# EAGLE design garage door opener v1.3 2015 07 16 (EAGLE 7.5.0)
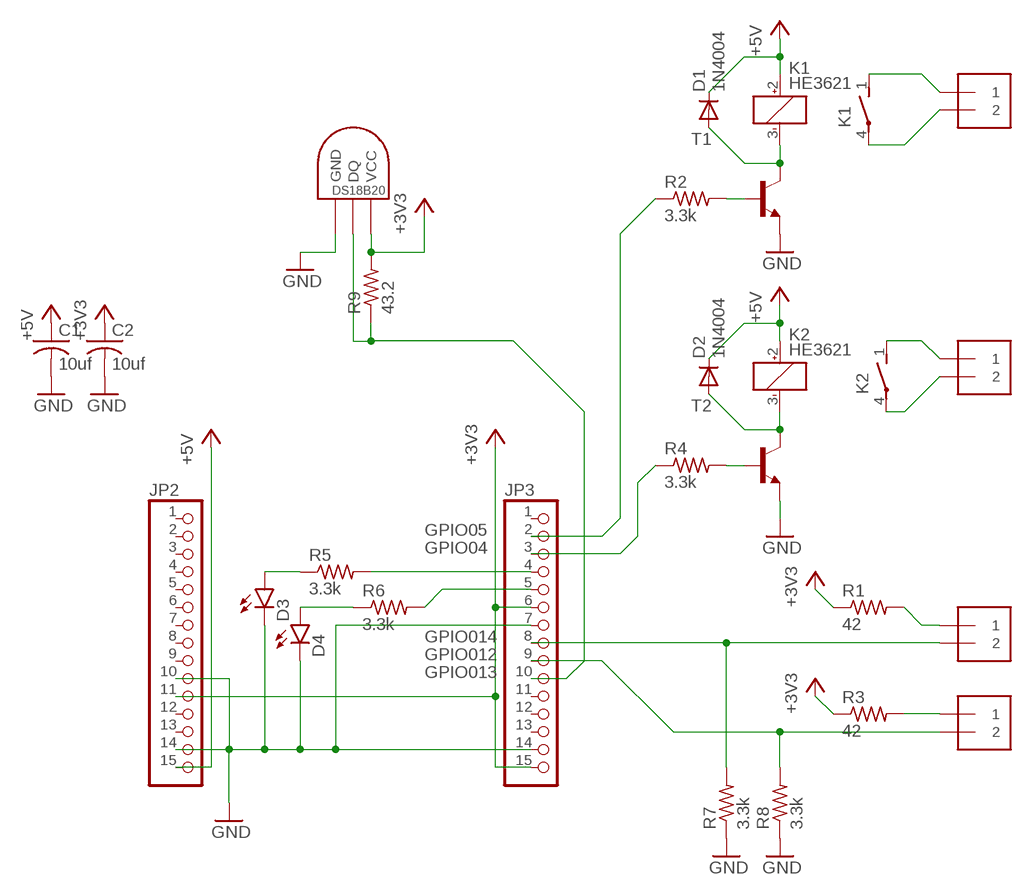
[diagram p0: schematic, sheet 1]

## Parts
C1  10uf  C-USC0603  [C0603]
C2  10uf  C-USC0603  [C0603]
D1  1N4004  DIODE-DO214BA  [DO214BA]
D2  1N4004  DIODE-DO214BA  [DO214BA]
D3  LED0603  [LED-0603]
D4  LED0603  [LED-0603]
DS18B20  DS18B20TO92  DS1820TO92  [DS1820]
JP2  PINHD-1X15  [1X15]
JP3  PINHD-1X15  [1X15]
K1  HE3621  [HE3621]
K2  HE3621  [HE3621]
OPEN1  1X2-3.5MM  [1X2-3.5MM]
OPEN2  1X2-3.5MM  [1X2-3.5MM]
R1  42  R-US_R0603  [R0603]
R2  3.3k  R-US_R0603  [R0603]
R3  42  R-US_R0603  [R0603]
R4  3.3k  R-US_R0603  [R0603]
R5  3.3k  R-US_R0603  [R0603]
R6  3.3k  R-US_R0603  [R0603]
R7  3.3k  R-US_R0603  [R0603]
R8  3.3k  R-US_R0603  [R0603]
R9  43.2  R-US_R0603  [R0603]
SENS1  1X2-3.5MM  [1X2-3.5MM]
SENS2  1X2-3.5MM  [1X2-3.5MM]
T1  MMBT3904LT1-NPN-SOT23-BEC  [SOT23-BEC]
T2  MMBT3904LT1-NPN-SOT23-BEC  [SOT23-BEC]

## Nets
+3V3: C2.1 DS18B20.VDD(VCC) JP2.11 JP3.6 JP3.15 R1.1 R3.1 R9.2
+5V: C1.1 D1.C D2.C JP2.15 K1.2(1:+) K2.2(1:+)
GND: C1.2 C2.2 D3.C D4.C DS18B20.GND JP2.10 JP2.14 JP3.7 JP3.14 R7.1 R8.1 T1.E T2.E
N$10: K1.1(2:S) OPEN1.1
N$11: K1.4(2:P) OPEN1.2
N$14: JP3.8 R7.2 SENS1.2
N$15: R1.2 SENS1.1
N$16: D1.A K1.3(1:-) T1.C
N$17: JP3.2 R2.1
N$18: R2.2 T1.B
N$19: JP3.4 R5.2
N$20: JP3.5 R6.2
N$21: R3.2 SENS2.1
N$22: JP3.9 R8.2 SENS2.2
N$23: K2.1(2:S) OPEN2.1
N$24: K2.4(2:P) OPEN2.2
N$25: D2.A K2.3(1:-) T2.C
N$26: JP3.3 R4.1
N$27: R4.2 T2.B
N$28: D4.A R6.1
N$29: D3.A R5.1
N$30: DS18B20.DQ JP3.10 R9.1
Unconnected: JP2.1 JP2.2 JP2.3 JP2.4 JP2.5 JP2.6 JP2.7 JP2.8 JP2.9 JP2.12 JP2.13 JP3.1 JP3.11 JP3.12 JP3.13

## Notes on the sheet
- GPIO05
- GPIO04
- GPIO014
- GPIO012
- GPIO013

## Library data of the parts
C1 C2 = resistor:C-US: CAPACITOR, American symbol
D1 D2 = diode:DIODE-: DIODE
D3 D4 = SparkFun-LED:LED: LEDs Standard schematic elements and footprints for 5mm, 3mm, 1206, and 0603 sized LEDs. 5mm - Spark Fun Electronics SKU : COM-00529 (and others)
DS18B20 = Ava:DS1820: DS18B20 Programmable Resolution 1-Wire Digital Thermometer Description The DS18B20 digital thermometer provides 9-bit to 12-bit Celsius temperature measurements and has an alarm function with nonvolatile user-programmable upper and lower trigger points. The DS18B20 communicates over a 1-Wire® bus that by definition requires only one data line (and ground) for communication with a central microprocessor. It has an operating temperature range of -55°C to +125°C and is accurate to ±0.5°C over the range of -10°C to +85°C. In addition, the DS18B20 can derive power directly from the data line ("parasite power"), eliminating the need for an external power supply. Each DS18B20 has a unique 64-bit serial code, which allows multiple DS18B20s to function on the same 1-Wire bus. Thus, it is simple to use one microprocessor to control many DS18B20s distributed over a large area. Applications that can benefit from this feature include HVAC environmental controls, temperature monitoring systems inside buildings, equipment, or machinery, and process monitoring and control systems.
JP2 JP3 = pinhead:PINHD-1X15: PIN HEADER
K1 K2 = relay:HE3621: RELAY reed, 1 x norm. open, grid 5.08 mm, Hamlin; MF: HAMLIN; MPN: HE3621A0510; OC_FARNELL: 9561943; OC_NEWARK: 50F7993
OPEN1 OPEN2 SENS1 SENS2 = adafruit:1X2: 3.5mm Terminal block http://www.ladyada.net/library/pcb/eaglelibrary.html; MPN: OSTTE020161
R1-R9 = resistor:R-US_: RESISTOR, American symbol
T1 T2 = transistor-neu-to92:*-NPN-: NPN Transistror; MPN: MMBT2222A

## Net classes
0 default: width 0.406 mm

## Board
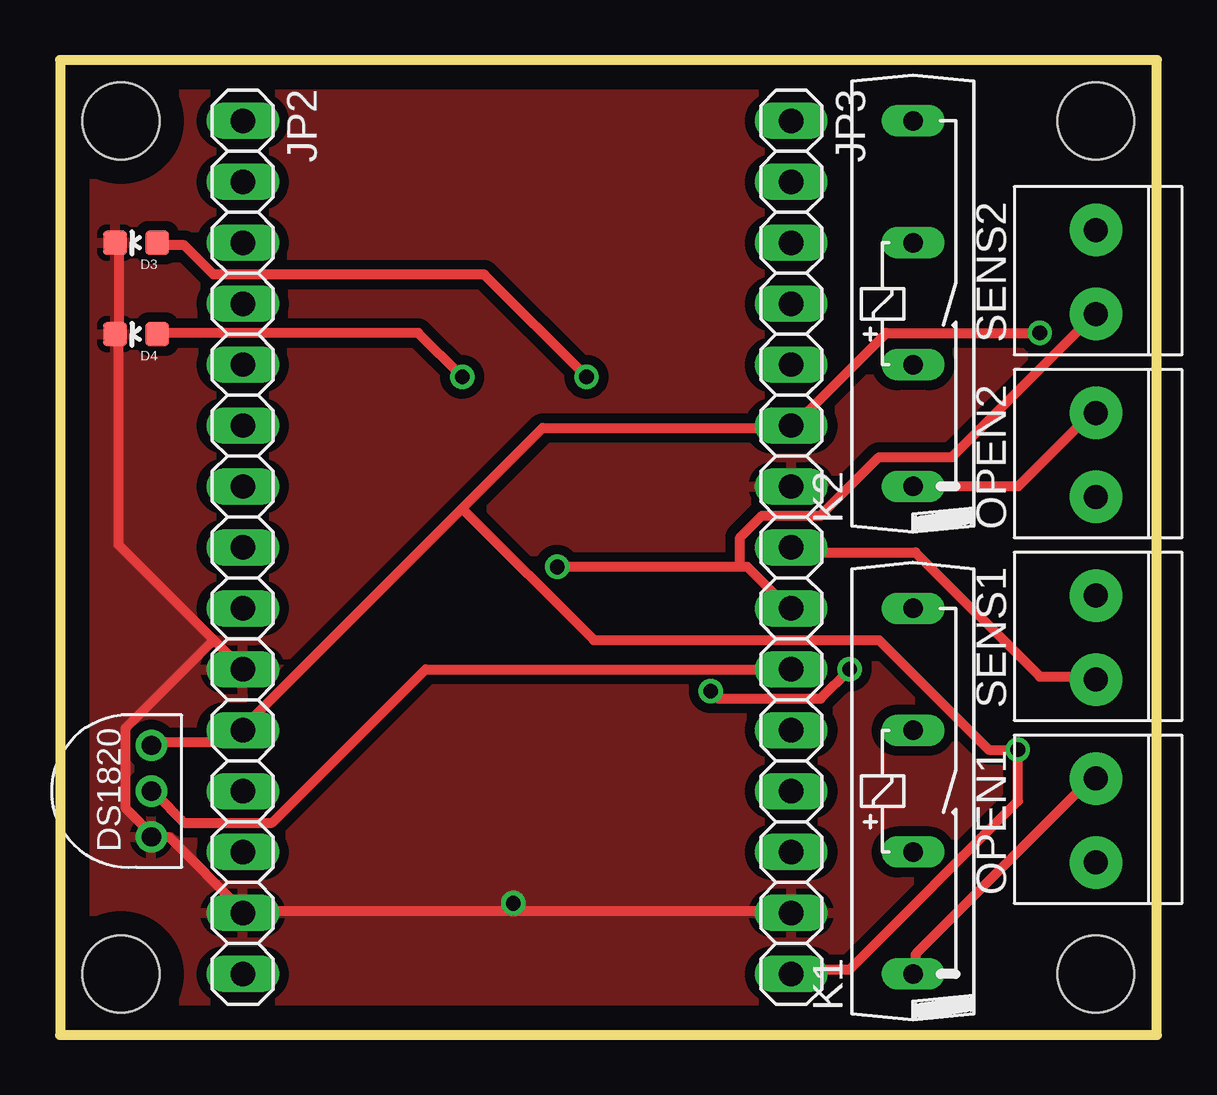
[diagram p1: board, top side]
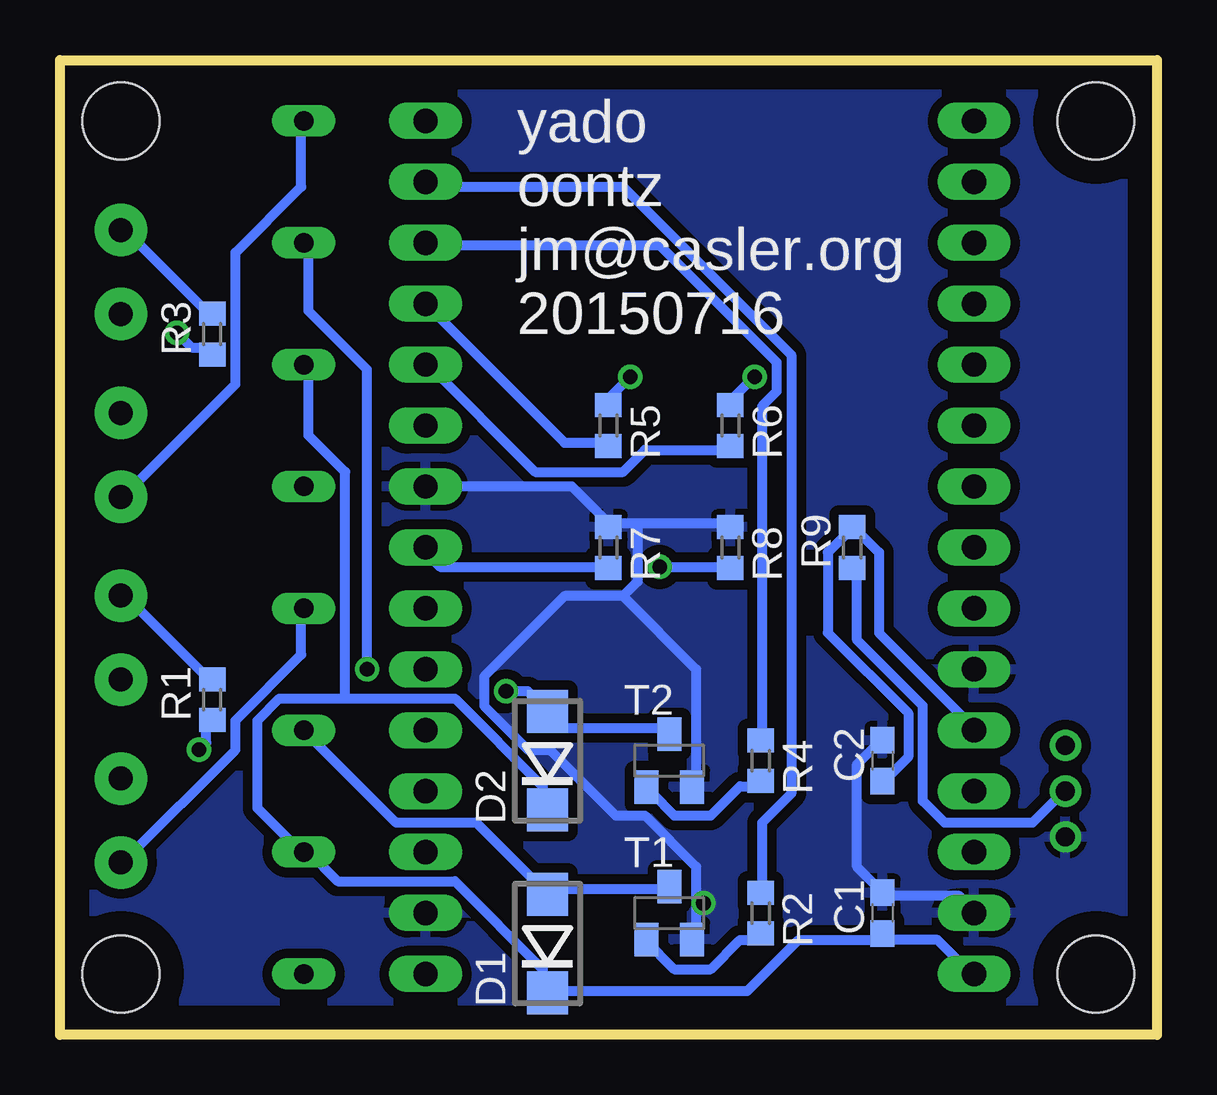
[diagram p2: board, bottom side, seen from below]

Size 45.72 x 40.64 mm. Coordinates in mm from the lower left corner, seen from the top.
Outline: 0,0 45.72,0 45.72,40.64 0,40.64 0,0
Copper layers (1*16): Top 0.035mm / dielectric 1.5mm / Bottom 0.035mm
Design rules "default *": minimum track width 10mil, minimum drill 24mil, track to track 8mil, track to pad 8mil, pad to pad 8mil, via to via 8mil, smd to smd 8mil, copper to edge 40mil, drill to drill 8mil, minimum pad ring 10mil, minimum via ring 8mil, stop-mask expansion 4mil, vias tented up to drill 25mil, thermal gap 10mil
Holes 3.2 mm at 2.54,38.1 2.54,2.54 43.18,38.1 43.18,2.54

### Footprints (pad centres in the part's own frame; a part is rotated, then mirrored left to right if it is on the bottom)
C0603 = smd 1.1 x 1: 1 -0.85,0; 2 0.85,0
DO214BA = smd 1.8 x 1.7: A 2.05,0; C -2.05,0
LED-0603 = smd 1 x 1: A 0,-0.877; C 0,0.877
DS1820 = drill 0.8: DQ 2.54,-1.27; GND 0.635,-1.27; VDD 4.445,-1.27
1X15 = drill 1.016 long: 1 -17.78,0; 2 -15.24,0; 3 -12.7,0; 4 -10.16,0; 5 -7.62,0; 6 -5.08,0; 7 -2.54,0; 8 0,0; 9 2.54,0; 10 5.08,0; 11 7.62,0; 12 10.16,0; 13 12.7,0; 14 15.24,0; 15 17.78,0
HE3621 = drill 0.813 long: 1 -7.62,0; 2 -2.54,0; 3 2.54,0; 4 7.62,0
1X2-3.5MM = drill 1 pad 2.184: 1 1.8,0; 2 -1.7,0
R0603 = smd 1 x 1.1: 1 -0.85,0; 2 0.85,0
SOT23-BEC = smd 1 x 1.4: B -0.95,-1.1; C 0,1.1; E 0.95,-1.1

### Placement (x,y rotation side)
C1  11.43,5.08 90 bottom
C2  11.43,11.43 90 bottom
D1  25.4,3.81 90 bottom
D2  25.4,11.43 90 bottom
D3  3.17,33.02 90 top
D4  3.17,29.21 90 top
DS18B20  2.54,7.62 90 top
JP2  7.62,20.32 270 top
JP3  30.48,20.32 270 top
K1  35.56,10.16 90 top
K2  35.56,30.48 90 top
OPEN1  43.18,8.89 90 top
OPEN2  43.18,24.13 90 top
R1  39.37,13.97 90 bottom
R2  16.51,5.08 270 bottom
R3  39.37,29.21 90 bottom
R4  16.51,11.43 270 bottom
R5  22.86,25.4 270 bottom
R6  17.78,25.4 270 bottom
R7  22.86,20.32 270 bottom
R8  17.78,20.32 270 bottom
R9  12.7,20.32 90 bottom
SENS1  43.18,16.51 90 top
SENS2  43.18,31.75 90 top
T1  20.32,5.08 0 bottom
T2  20.32,11.43 0 bottom

### Tracks (layer width: path | path; a pad name or v marks a point on that pad's centre or on a via)
+3V3  (via drill 0.61)
  Top 0.406: JP3.15 30.48,2.74 32.92,2.74 39.93,9.75 v39.93,11.89 38.71,11.89 34.14,16.46 22.25,16.46 16.76,21.95 | v40.84,29.26 34.44,29.26 30.48,25.3 | DS18B20.VDD 3.96,12.19 7.32,12.19 7.62,12.5 JP2.11 7.62,12.8 16.76,21.95 | 30.48,25.3 20.12,25.3 16.76,21.95 | 30.48,25.3 JP3.6
  Bottom 0.406: v39.93,11.89 39.62,12.19 39.62,13.11 R1.1 | v40.84,29.26 40.23,28.65 39.62,28.65 R3.1 | C2.1 11.28,10.67 10.36,11.58 10.36,13.41 13.72,16.76 13.72,20.12 12.8,21.03 R9.2 12.5,21.03 11.58,20.12 11.58,16.76 7.62,12.8 JP2.11
+5V
  Bottom 0.406: JP2.15 7.62,2.44 9.14,3.96 11.28,3.96 C1.1 11.58,3.96 14.94,3.96 17.07,1.83 25.3,1.83 D1.C 25.6,1.83 25.6,2.74 29.26,6.4 34.14,6.4 35.36,7.62 K1.2 35.66,7.62 37.49,9.45 37.49,13.11 36.58,14.02 33.83,14.02 | 33.83,14.02 29.26,14.02 25.6,10.36 25.6,9.45 D2.C | 33.83,14.02 33.83,23.47 35.36,24.99 35.36,27.74 K2.2
GND  (via drill 0.61)
  Top 0.406: D3.C 2.44,32.92 2.44,29.26 D4.C 2.44,28.96 2.44,20.42 6.4,16.46 | JP2.10 6.4,16.46 | 7.62,5.18 4.57,8.23 3.96,8.23 DS18B20.GND 3.66,8.53 2.74,9.45 2.74,12.8 6.4,16.46 | 7.62,5.18 18.9,5.18 | 18.9,5.18 30.48,5.18 JP3.14 | 7.62,5.18 JP2.14 | 18.9,5.18 v18.9,5.49
  Bottom 0.406: 22.86,21.34 21.64,21.34 | 21.64,21.34 17.98,21.34 R8.1 | 19.2,5.49 19.2,7.01 21.34,9.14 22.55,9.14 25.3,11.89 26.21,11.89 28.04,13.72 28.04,14.94 24.69,18.29 22.25,18.29 | 19.2,5.49 19.2,4.27 T1.E | 22.25,18.29 21.64,18.9 21.64,21.34 | 22.25,18.29 19.2,15.24 19.2,10.36 T2.E | JP3.7 24.38,22.86 22.86,21.34 | 22.86,21.34 R7.1 | JP2.14 7.62,5.18 8.23,5.79 11.28,5.79 C1.2 11.58,6.1 12.5,7.01 12.5,11.28 11.58,12.19 C2.2 | v18.9,5.49 19.2,5.49
  pour Top (isolate 0.406): -1.27,41.91 46.99,41.91 46.99,-1.27 -1.27,-1.27
  pour Bottom (isolate 0.406): -2.54,43.18 48.26,43.18 48.26,-2.54 -2.54,-2.54
N$10
  Top 0.406: K1.1 35.66,2.74 35.66,3.35 42.98,10.67 OPEN1.1
N$11
  Bottom 0.406: K1.4 35.66,17.68 35.66,15.85 38.41,13.11 38.41,11.89 42.98,7.32 OPEN1.2
N$14
  Top 0.406: SENS1.2 42.98,14.94 40.84,14.94 35.66,20.12 30.48,20.12 JP3.8
  Bottom 0.406: R7.2 22.86,19.51 29.87,19.51 30.48,20.12 JP3.8
N$15
  Bottom 0.406: R1.2 39.62,14.94 42.98,18.29 SENS1.1
N$16
  Bottom 0.406: T1.C 20.42,6.1 25.3,6.1 D1.A 25.6,6.1 28.35,8.84 31.7,8.84 K1.3
N$17
  Bottom 0.406: R2.1 16.46,6.1 16.46,8.84 15.24,10.06 15.24,28.35 22.25,35.36 30.48,35.36 JP3.2
N$18
  Bottom 0.406: R2.2 16.76,3.96 17.37,3.96 18.59,2.74 20.12,2.74 21.34,3.96 T1.B
N$19
  Bottom 0.406: JP3.4 24.69,24.69 22.86,24.69 R5.2
N$20
  Bottom 0.406: R6.2 17.98,24.38 21.34,24.38 22.25,23.47 25.91,23.47 30.48,28.04 JP3.5
N$21
  Bottom 0.406: R3.2 39.62,30.18 42.98,33.53 SENS2.1
N$22  (via drill 0.61)
  Top 0.406: 28.35,19.51 28.65,19.51 30.48,17.68 JP3.9 | 28.35,19.51 v20.73,19.51 | 28.35,19.51 28.35,20.73 29.26,21.64 31.7,21.64 34.14,24.08 37.19,24.08 42.98,29.87 SENS2.2
  Bottom 0.406: v20.73,19.51 17.98,19.51 R8.2
N$23
  Top 0.406: K2.1 39.93,22.86 42.98,25.91 OPEN2.1
N$24
  Bottom 0.406: K2.4 35.66,38.1 35.66,35.36 38.41,32.61 38.41,27.13 42.98,22.55 OPEN2.2
N$25  (via drill 0.61)
  Top 0.406: v32.92,15.24 31.7,14.02 27.43,14.02 v27.13,14.33
  Bottom 0.406: T2.C 20.42,12.8 24.69,12.8 25.3,13.41 D2.A 25.6,13.72 26.21,14.33 v27.13,14.33 | v32.92,15.24 32.92,27.74 35.36,30.18 35.36,32.92 K2.3
N$26
  Bottom 0.406: R4.1 16.46,12.5 16.46,26.21 15.85,26.82 15.85,28.04 20.73,32.92 30.48,32.92 JP3.3
N$27
  Bottom 0.406: R4.2 16.76,10.36 17.37,10.36 18.59,9.14 20.12,9.14 21.03,10.06 T2.B
N$28  (via drill 0.61)
  Top 0.406: v16.76,27.43 14.94,29.26 4.27,29.26 D4.A
  Bottom 0.406: v16.76,27.43 17.68,26.52 R6.1
N$29  (via drill 0.61)
  Top 0.406: v21.95,27.43 17.68,31.7 6.4,31.7 5.18,32.92 4.27,32.92 D3.A
  Bottom 0.406: v21.95,27.43 22.86,26.52 R5.1
N$30
  Top 0.406: JP3.10 15.24,15.24 8.84,8.84 5.18,8.84 3.96,10.06 DS18B20.DQ
  Bottom 0.406: R9.1 12.5,19.2 12.5,16.46 9.75,13.72 9.75,9.75 8.84,8.84 5.18,8.84 3.96,10.06 DS18B20.DQ

### Text on the board
bPlace: yado / oontz / jm@casler.org / 20150716